# EAGLE board Aqua_D_CTRL (EAGLE 9.6.2)
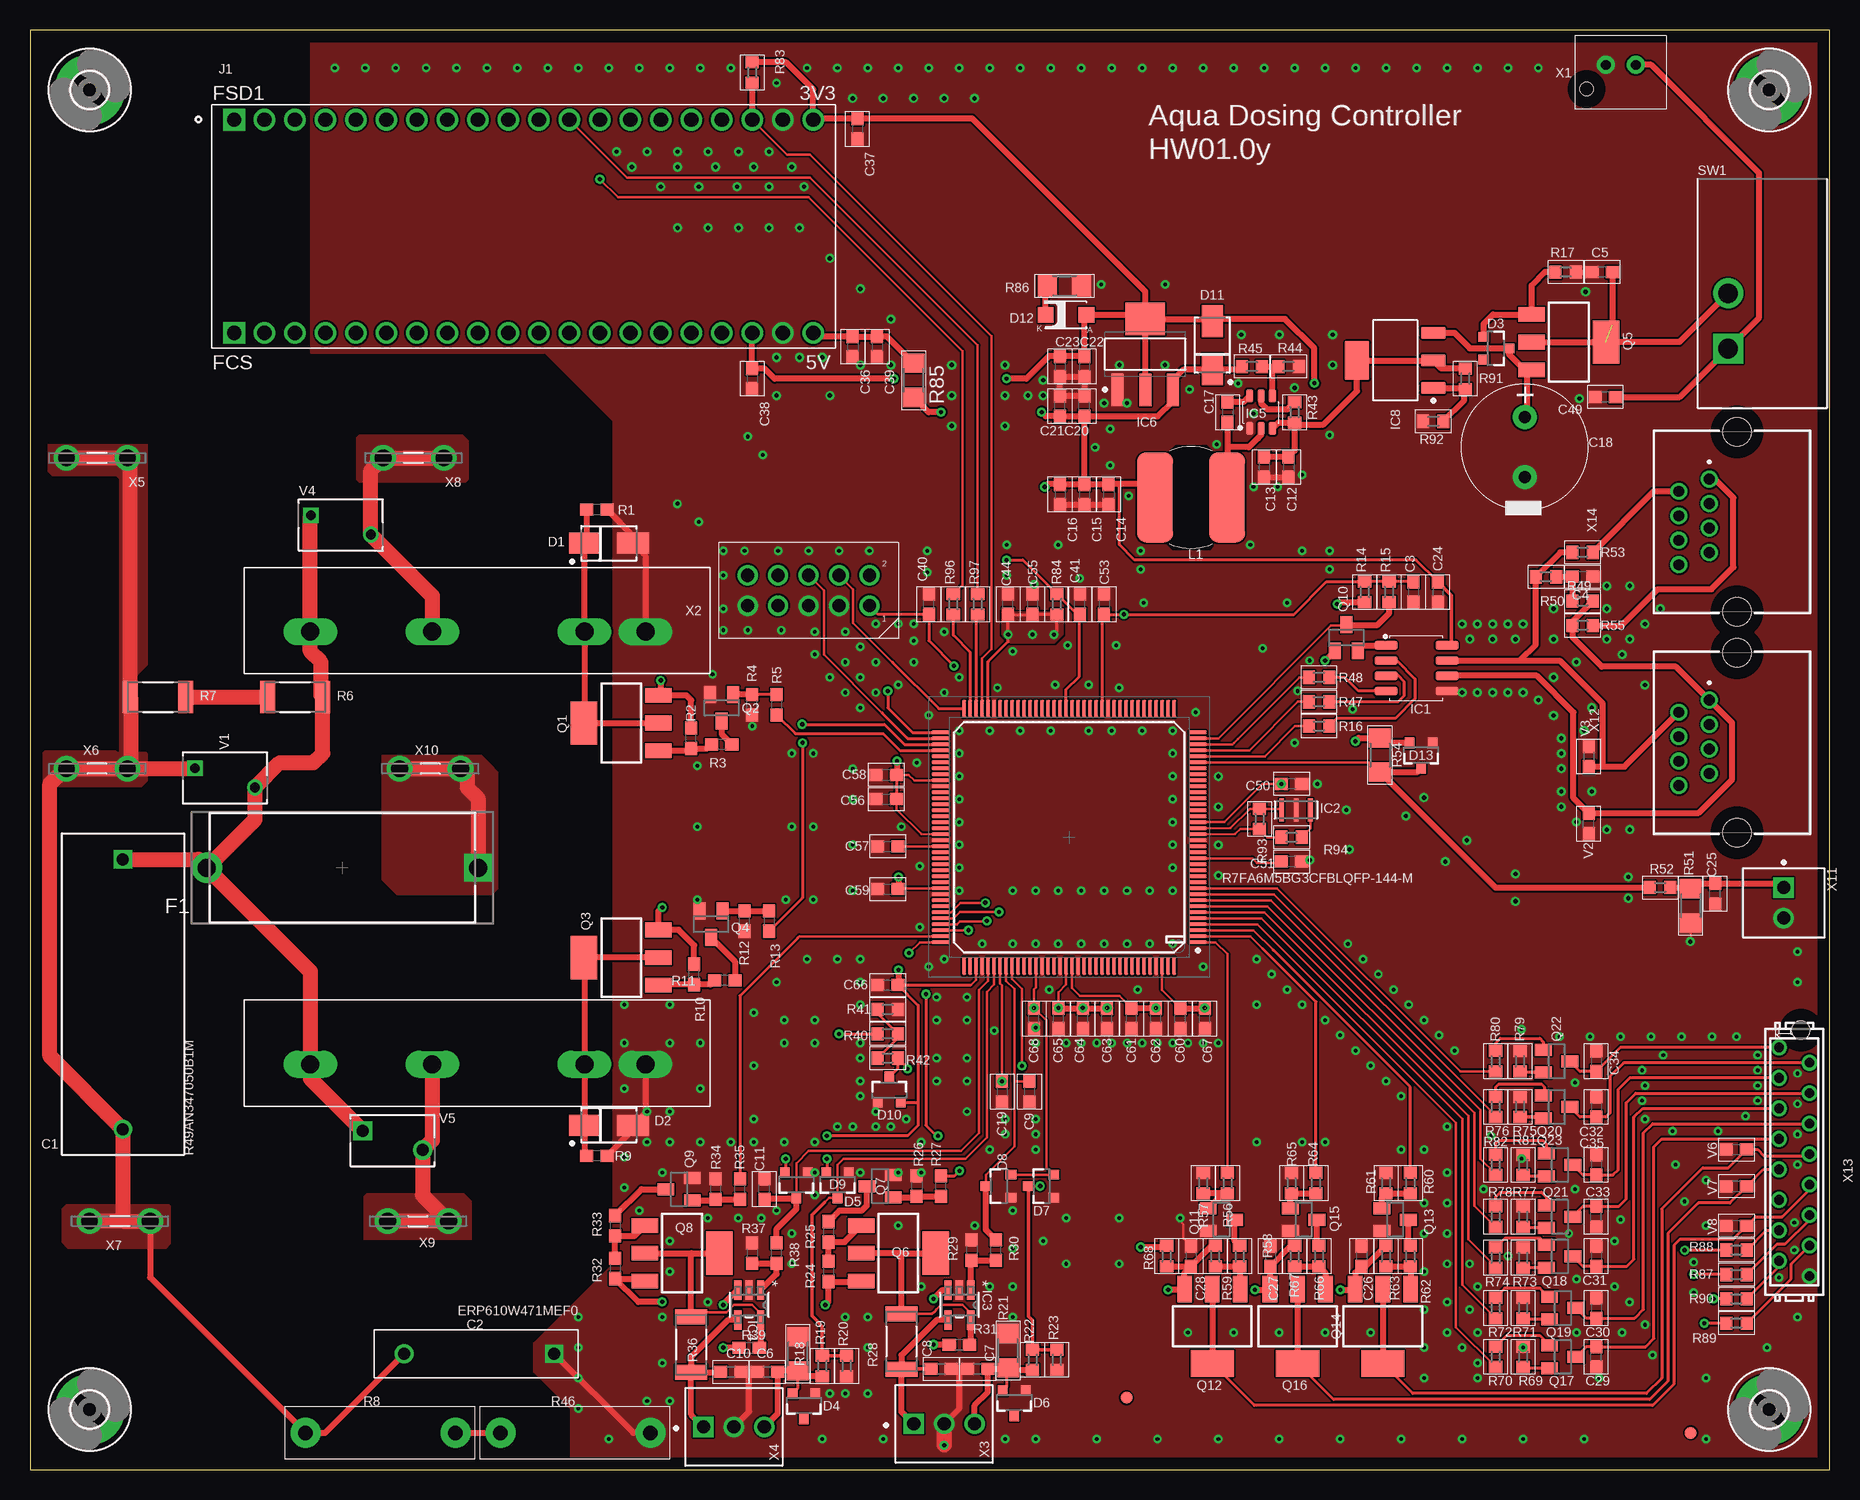
[diagram p10: board, top side]
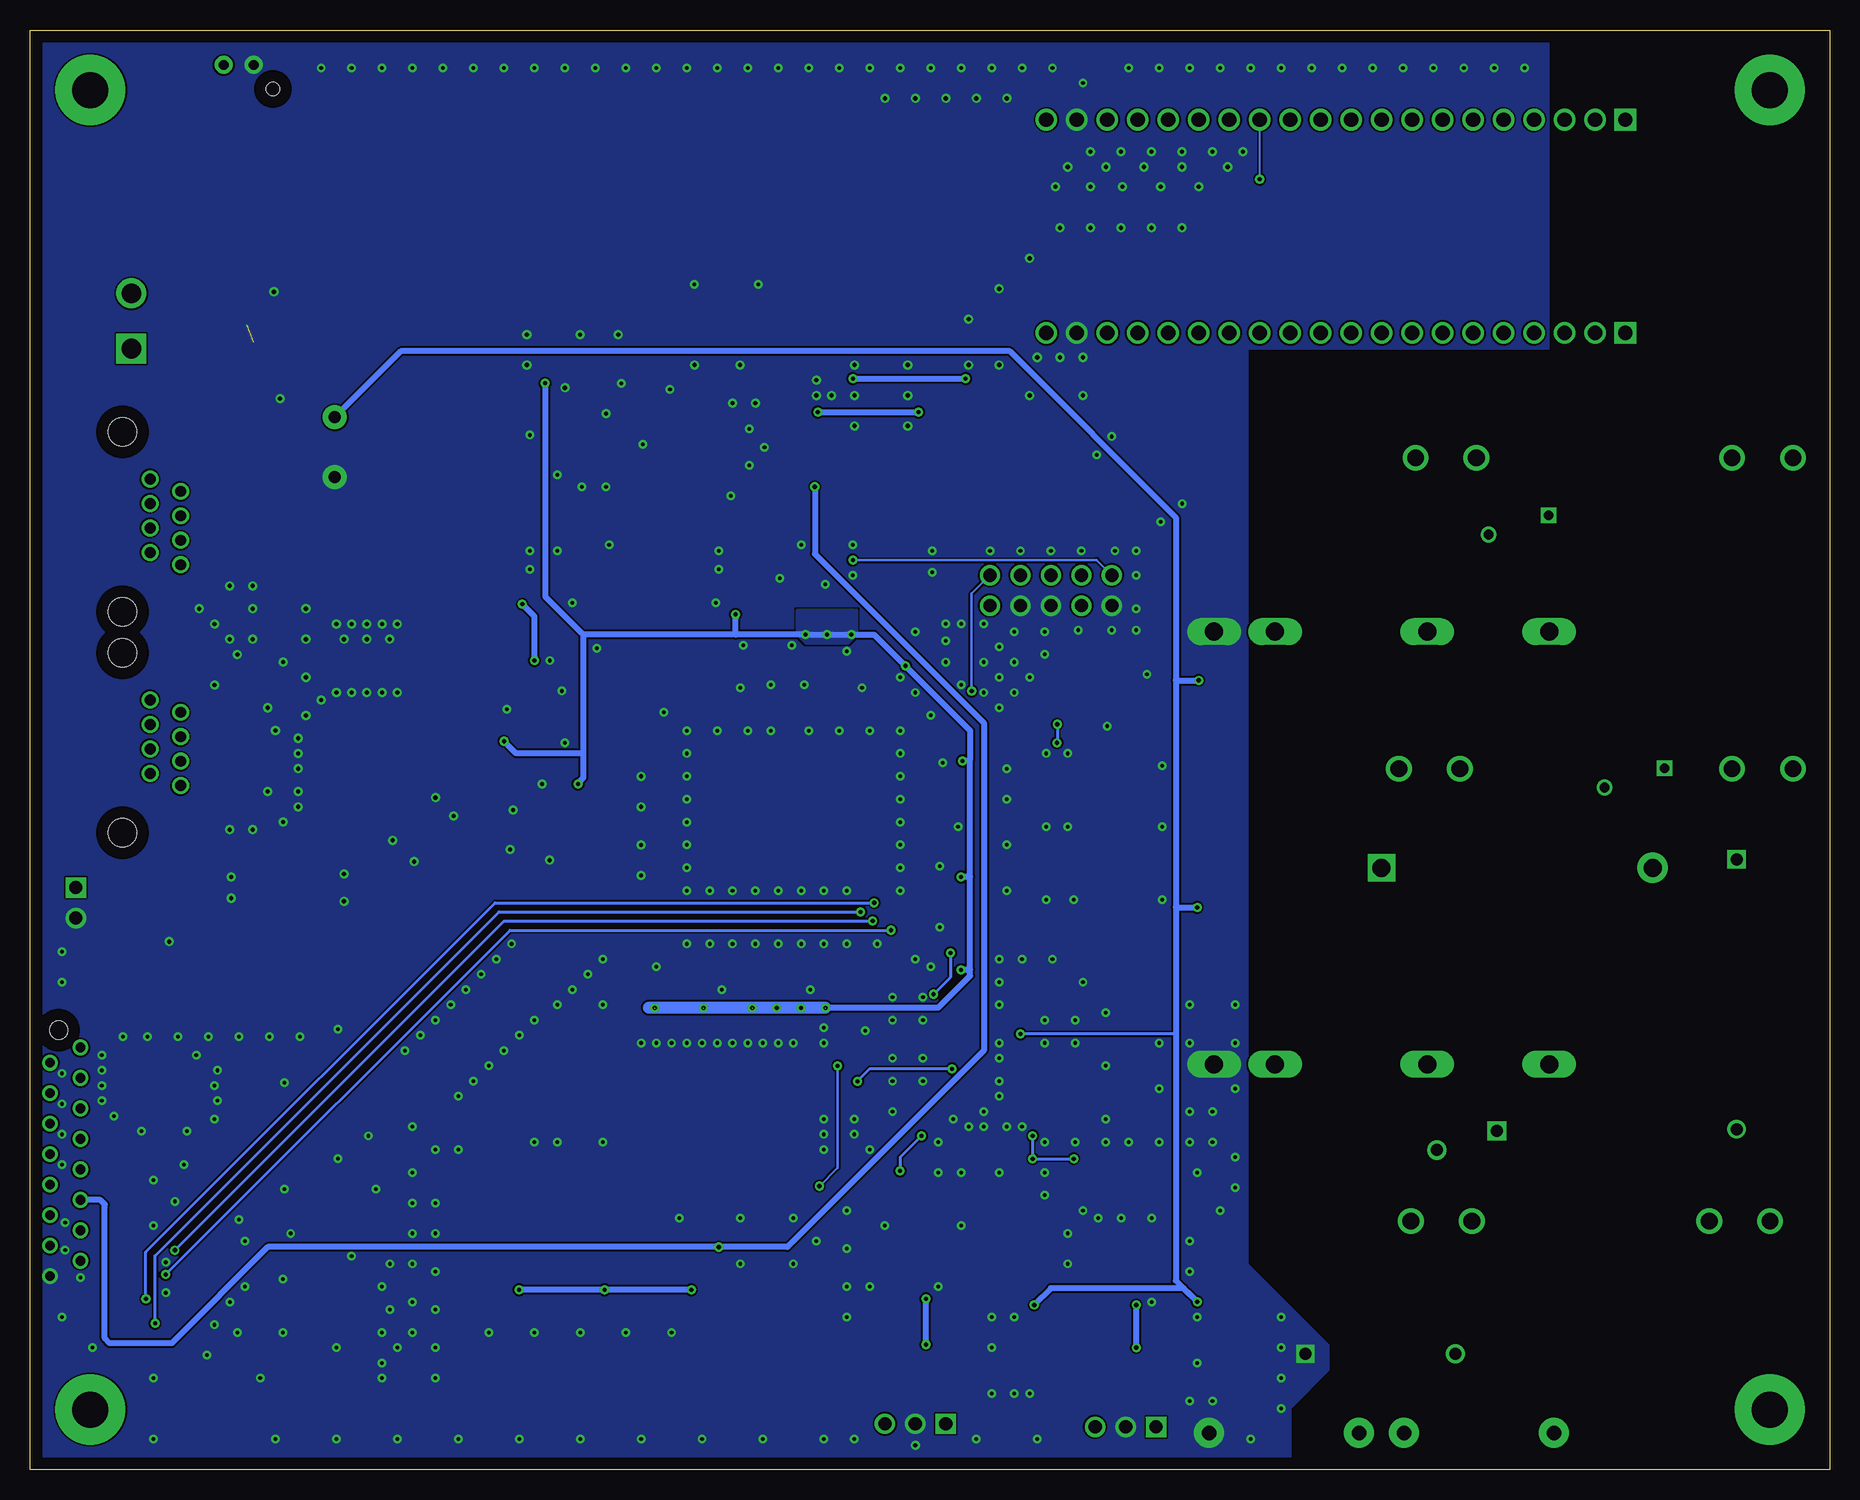
[diagram p11: board, bottom side, seen from below]

Size 150 x 120 mm. Coordinates in mm from the lower left corner, seen from the top.
Outline: 0,0 150,0 150,120 0,120 0,0
Copper layers (1*16): Top 0.035mm / dielectric 1.5mm / Bottom 0.035mm
Design rules "default *": minimum track width 6mil, minimum drill 0.35mm, track to track 6mil, track to pad 6mil, pad to pad 6mil, via to via 6mil, smd to smd 0mil, copper to edge 40mil, drill to drill 6mil, minimum pad ring 10mil, minimum via ring 8mil, stop-mask expansion 4mil, vias tented up to drill 1mm, thermal gap 10mil
Net classes: 1 Mains_N: clearance 3.2 mm to class 0, clearance 0.2 mm; 3 LV: clearance 8 mm to class 1; 4 Mains_L: clearance 8 mm to class 0, clearance 3.2 mm to class 1, clearance 8 mm to class 3

## Footprints (pad centres in the part's own frame; a part is rotated, then mirrored left to right if it is on the bottom)
R49AN347050B1M = drill 1 pad 1.55 square: 1 -11.25,0 | drill 1 pad 1.55: 2 11.25,0
CAP-P12.5-H15-W4-D1 = drill 1 square: P$1 0,0 | drill 1 pad 1.6: P$2 12.5,0
0603 = smd 1.1 x 1: 1 -0.85,0; 2 0.85,0
CAPACITOR-ELKO-RM5-10X16 = drill 1 pad 2: 1 -2.5,0; 2 2.5,0
SMA = smd 2.65 x 1.75: 1 -2.015,0; 2 2.015,0
SOT23-3 = smd 0.8 x 0.9: 1 -0.95,-1; 2 0.95,-1; 3 0,1.1
SMD1206-LED = smd 1.3 x 1.3: 1 -1.7,0; 2 1.7,0
FUSE_RM22.6 = drill 1.5 pad 2.3 square: 1 -11.3,0 | drill 1.5 pad 2.54: 2 11.3,0
FIDUCIAL = smd 1 x 1: P$1 0,0
3,0-PAD = drill 3 pad 5.842: B3,0 0,0
SOIC8 = smd 1.9 x 0.72: 1 -2.54,1.905; 2 -2.54,0.635; 3 -2.54,-0.635; 4 -2.54,-1.905; 5 2.54,-1.905; 6 2.54,-0.635; 7 2.54,0.635; 8 2.54,1.905
CSTNE8M00G520000R0 = smd 0.4 x 1.9: 1 -1.2,0; 2 0,0; 3 1.2,0
SOT-23-5 = smd 1.626 x 0.61: 1 -1.245,0.95; 2 -1.245,0; 3 -1.245,-0.95; 4 1.245,-0.95; 5 1.245,0.95
SOT23-6 = smd 0.6 x 1.1: 1 -0.95,-1.35; 2 0,-1.35; 3 0.95,-1.35; 4 0.95,1.35; 5 0,1.35; 6 -0.95,1.35
SOT223_LD1117S33TR = smd 2.7 x 1: 1 -2.95,2.3; 2 -2.95,0; 3 -2.95,-2.3 | smd 2.7 x 3.3: 4 2.95,0
SOT223_LM317AEMP = smd 2.05 x 1: 1 -3.175,2.3; 2 -3.175,0; 3 -3.175,-2.3 | smd 2.05 x 3.25: 4 3.175,0
XCVR_ESP32-PICO-KIT = drill 1.2 square: J2_1 -24.13,8.89; J3_1 -24.13,-8.89 | drill 1.2: J2_2 -21.59,8.89; J2_3 -19.05,8.89; J2_4 -16.51,8.89; J2_5 -13.97,8.89; J2_6 -11.43,8.89; J2_7 -8.89,8.89; J2_8 -6.35,8.89; J2_9 -3.81,8.89; J2_10 -1.27,8.89; J2_11 1.27,8.89; J2_12 3.81,8.89; J2_13 6.35,8.89; J2_14 8.89,8.89; J2_15 11.43,8.89; J2_16 13.97,8.89; J2_17 16.51,8.89; J2_18 19.05,8.89; J2_19 21.59,8.89; J2_20 24.13,8.89; J3_2 -21.59,-8.89; J3_3 -19.05,-8.89; J3_4 -16.51,-8.89; J3_5 -13.97,-8.89; J3_6 -11.43,-8.89; J3_7 -8.89,-8.89; J3_8 -6.35,-8.89; J3_9 -3.81,-8.89; J3_10 -1.27,-8.89; J3_11 1.27,-8.89; J3_12 3.81,-8.89; J3_13 6.35,-8.89; J3_14 8.89,-8.89; J3_15 11.43,-8.89; J3_16 13.97,-8.89; J3_17 16.51,-8.89; J3_18 19.05,-8.89; J3_19 21.59,-8.89; J3_20 24.13,-8.89
RELAY_KYOTO_KF0604D = drill 1.5 long: P$1 0,0; P$2 -5.08,0; P$3 -17.78,0; P$4 -27.94,0
SRN8040TA-220M = smd 3 x 7.5: 1 -3,0; 2 3,0
SOT223 = smd 1.219 x 2.235: 1 -2.311,-3.099; 2 0,-3.099; 3 2.311,-3.099 | smd 3.6 x 2.2: 4 0,3.099
SOT23 = smd 1 x 1.4: 1 -0.95,-1.1; 2 0.95,-1.1; 3 0,1.1
R2010 = smd 1.256 x 2.658: 1 -2.301,0; 2 2.301,0
RES-RM12.5-VR37 = drill 1.2 pad 2.5: 1 -6.25,0; 2 6.25,0
R0603 = smd 1 x 1.1: 1 -0.85,0; 2 0.85,0
R1206 = smd 1.6 x 1.803: 1 -1.422,0; 2 1.422,0
L101011MS02Q = drill 1.65 pad 2.5 square: 1 -2.85,-4.6 | drill 1.65 pad 2.5: 2 -2.85,0
LQFP-144-M = smd 1.45 x 0.3: 1 -10.725,8.75; 2 -10.725,8.25; 3 -10.725,7.75; 4 -10.725,7.25; 5 -10.725,6.75; 6 -10.725,6.25; 7 -10.725,5.75; 8 -10.725,5.25; 9 -10.725,4.75; 10 -10.725,4.25; 11 -10.725,3.75; 12 -10.725,3.25; 13 -10.725,2.75; 14 -10.725,2.25; 15 -10.725,1.75; 16 -10.725,1.25; 17 -10.725,0.75; 18 -10.725,0.25; 19 -10.725,-0.25; 20 -10.725,-0.75; 21 -10.725,-1.25; 22 -10.725,-1.75; 23 -10.725,-2.25; 24 -10.725,-2.75; 25 -10.725,-3.25; 26 -10.725,-3.75; 27 -10.725,-4.25; 28 -10.725,-4.75; 29 -10.725,-5.25; 30 -10.725,-5.75; 31 -10.725,-6.25; 32 -10.725,-6.75; 33 -10.725,-7.25; 34 -10.725,-7.75; 35 -10.725,-8.25; 36 -10.725,-8.75; 73 10.725,-8.75; 74 10.725,-8.25; 75 10.725,-7.75; 76 10.725,-7.25; 77 10.725,-6.75; 78 10.725,-6.25; 79 10.725,-5.75; 80 10.725,-5.25; 81 10.725,-4.75; 82 10.725,-4.25; 83 10.725,-3.75; 84 10.725,-3.25; 85 10.725,-2.75; 86 10.725,-2.25; 87 10.725,-1.75; 88 10.725,-1.25; 89 10.725,-0.75; 90 10.725,-0.25; 91 10.725,0.25; 92 10.725,0.75; 93 10.725,1.25; 94 10.725,1.75; 95 10.725,2.25; 96 10.725,2.75; 97 10.725,3.25; 98 10.725,3.75; 99 10.725,4.25; 100 10.725,4.75; 101 10.725,5.25; 102 10.725,5.75; 103 10.725,6.25; 104 10.725,6.75; 105 10.725,7.25; 106 10.725,7.75; 107 10.725,8.25; 108 10.725,8.75 | smd 0.3 x 1.45: 37 -8.75,-10.725; 38 -8.25,-10.725; 39 -7.75,-10.725; 40 -7.25,-10.725; 41 -6.75,-10.725; 42 -6.25,-10.725; 43 -5.75,-10.725; 44 -5.25,-10.725; 45 -4.75,-10.725; 46 -4.25,-10.725; 47 -3.75,-10.725; 48 -3.25,-10.725; 49 -2.75,-10.725; 50 -2.25,-10.725; 51 -1.75,-10.725; 52 -1.25,-10.725; 53 -0.75,-10.725; 54 -0.25,-10.725; 55 0.25,-10.725; 56 0.75,-10.725; 57 1.25,-10.725; 58 1.75,-10.725; 59 2.25,-10.725; 60 2.75,-10.725; 61 3.25,-10.725; 62 3.75,-10.725; 63 4.25,-10.725; 64 4.75,-10.725; 65 5.25,-10.725; 66 5.75,-10.725; 67 6.25,-10.725; 68 6.75,-10.725; 69 7.25,-10.725; 70 7.75,-10.725; 71 8.25,-10.725; 72 8.75,-10.725; 109 8.75,10.725; 110 8.25,10.725; 111 7.75,10.725; 112 7.25,10.725; 113 6.75,10.725; 114 6.25,10.725; 115 5.75,10.725; 116 5.25,10.725; 117 4.75,10.725; 118 4.25,10.725; 119 3.75,10.725; 120 3.25,10.725; 121 2.75,10.725; 122 2.25,10.725; 123 1.75,10.725; 124 1.25,10.725; 125 0.75,10.725; 126 0.25,10.725; 127 -0.25,10.725; 128 -0.75,10.725; 129 -1.25,10.725; 130 -1.75,10.725; 131 -2.25,10.725; 132 -2.75,10.725; 133 -3.25,10.725; 134 -3.75,10.725; 135 -4.25,10.725; 136 -4.75,10.725; 137 -5.25,10.725; 138 -5.75,10.725; 139 -6.25,10.725; 140 -6.75,10.725; 141 -7.25,10.725; 142 -7.75,10.725; 143 -8.25,10.725; 144 -8.75,10.725
EPCOS_B72205S0271K101_0 = drill 0.8 pad 1.3 square: 1 -2.5,0.8 | drill 0.8 pad 1.3: 2 2.5,-0.8
EPCOS_B72205S0271K101_MODIFIED = drill 1 pad 1.6 square: 1 -2.5,0.8 | drill 1 pad 1.6: 2 2.5,-0.8
B2B-XH-AM(LF)(SN) = drill 0.8 pad 1.5: 1 0,0; 2 2.5,0 | hole 1.1: 4.1,2
X10_100MIL_2XROW_VERT = drill 1.1 pad 1.7: 1 -5.08,1.27; 2 -5.08,-1.27; 3 -2.54,1.27; 4 -2.54,-1.27; 5 0,1.27; 6 0,-1.27; 7 2.54,1.27; 8 2.54,-1.27; 9 5.08,1.27; 10 5.08,-1.27
TE_282834-3_0 = drill 1.1 pad 1.7 square: 1 0,2.54 | drill 1.1 pad 1.7: 2 0,0; 3 0,-2.54
TE_726386-2 = drill 1.4 pad 2.15: 1 -2.54,0; 1-2 2.54,0
TE_282834-2_0 = drill 1.1 pad 1.7 square: 1 -1.27,0 | drill 1.1 pad 1.7: 2 1.27,0
615008148521 = drill 0.9: 1 3.57,1.875; 2 2.55,4.415; 3 1.53,1.875; 4 0.51,4.415; 5 -0.51,1.875; 6 -1.53,4.415; 7 -2.55,1.875; 8 -3.57,4.415 | hole 2.36: -7.5,-0.425; 7.5,-0.425
MICROMATCH-16 = drill 0.813: 1 9.525,1.27; 2 8.255,-1.27; 3 6.985,1.27; 4 5.715,-1.27; 5 4.445,1.27; 6 3.175,-1.27; 7 1.905,1.27; 8 0.635,-1.27; 9 -0.635,1.27; 10 -1.905,-1.27; 11 -3.175,1.27; 12 -4.445,-1.27; 13 -5.715,1.27; 14 -6.985,-1.27; 15 -8.255,1.27; 16 -9.525,-1.27 | hole 1.5: 10.97,-0.55

## Placement (x,y rotation side)
C1  R49AN347050B1M  [R49AN347050B1M]  7.75,39.62 270 top
C2  ERP610W471MEF0  [CAP-P12.5-H15-W4-D1]  43.69,9.65 180 top
C3  100nF/100V  [0603]  115.32,73.15 270 top
C4  100nF/100V  [0603]  129.41,74.42 0 top
C5  100nF/ 100V  [0603]  131.06,99.82 180 top
C6  100nF/100V  [0603]  61.47,8.13 0 top
C7  100nF/100V  [0603]  78.99,8.38 0 top
C8  100nF/100V  [0603]  75.95,8.38 0 top
C9  100nF/100V  [0603]  83.31,31.5 270 top
C10  100nF/100V  [0603]  58.42,8.13 0 top
C11  100nF/100V  [0603]  61.21,23.37 90 top
C12  100nF/ 100V  [0603]  104.9,83.57 270 top
C13  100nF/ 100V  [0603]  102.87,83.57 270 top
C14  10uF/25V  [0603]  89.92,81.28 270 top
C15  10uF/25V  [0603]  87.88,81.28 270 top
C16  10uF/25V  [0603]  85.85,81.28 270 top
C17  100nF/ 100V  [0603]  99.82,88.14 270 top
C18  50PX470MEFC10X20  [CAPACITOR-ELKO-RM5-10X16]  124.59,85.22 270 top
C19  100nF/ 100V  [0603]  81.03,31.5 270 top
C20  10uF/25V  [0603]  87.88,88.65 90 top
C21  100nF/ 100V  [0603]  85.85,88.65 90 top
C22  10uF/25V  [0603]  87.88,91.95 270 top
C23  100nF/ 100V  [0603]  85.85,91.95 270 top
C24  100nF/100V  [0603]  117.35,73.15 270 top
C25  100nF/100V  [0603]  140.46,48.01 90 top
C26  100nF/50V  [0603]  111,17.78 270 top
C27  100nF/50V  [0603]  103.38,17.78 270 top
C28  100nF/50V  [0603]  96.77,17.78 270 top
C29  100nF/50V  [0603]  130.56,9.4 90 top
C30  100nF/50V  [0603]  130.56,13.46 270 top
C31  100nF/50V  [0603]  130.56,17.78 270 top
C32  100nF/50V  [0603]  130.56,30.23 270 top
C33  100nF/50V  [0603]  130.56,21.08 90 top
C34  100nF/50V  [0603]  130.56,34.04 270 top
C35  100nF/50V  [0603]  130.56,25.4 270 top
C36  1uF/25V  [0603]  68.58,93.6 270 top
C37  1uF/25V  [0603]  68.96,111.76 270 top
C38  100nF/100V  [0603]  60.2,90.93 270 top
C39  100nF/100V  [0603]  70.61,93.6 270 top
C40  1uF/25V  [0603]  74.93,72.14 90 top
C41  100nF/50V  [0603]  87.5,72.14 90 top
C44  1uF/25V  [0603]  81.53,72.14 90 top
C49  100nF/ 100V  [0603]  131.32,89.41 180 top
C50  100nF/50V  [0603]  105.16,57.15 180 top
C51  100nF/50V  [0603]  105.16,50.67 180 top
C53  100nF/50V  [0603]  89.53,72.14 270 top
C55  100nF/50V  [0603]  83.57,72.14 270 top
C56  100nF/50V  [0603]  71.37,55.88 0 top
C57  100nF/50V  [0603]  71.5,51.94 0 top
C58  100nF/50V  [0603]  71.37,57.91 0 top
C59  100nF/50V  [0603]  71.5,48.39 0 top
C60  100nF/50V  [0603]  95.89,37.59 90 top
C61  100nF/50V  [0603]  91.82,37.59 90 top
C62  10uF/25V  [0603]  93.85,37.59 90 top
C63  100nF/50V  [0603]  89.79,37.59 90 top
C64  10uF/25V  [0603]  87.76,37.59 90 top
C65  1uF/25V  [0603]  85.72,37.59 90 top
C66  100nF/50V  [0603]  71.5,40.39 0 top
C67  1uF/16V  [0603]  97.92,37.59 90 top
C68  100nF/50V  [0603]  83.69,37.59 90 top
D1  SS14  [SMA]  48.26,77.22 0 top
D2  SS14  [SMA]  48.26,28.7 0 top
D3  MMBZ4696-HE3-18  [SOT23-3]  122.17,93.47 270 top
D4  PESD36VS2UT  [SOT23-3]  64.52,5.33 180 top
D5  BAS40-04,215  [SOT23-3]  67.31,23.75 180 top
D6  PESD36VS2UT  [SOT23-3]  82.04,5.59 180 top
D7  BAS40-04,215  [SOT23-3]  84.33,23.62 90 top
D8  BAS40-04,215  [SOT23-3]  80.77,23.62 90 top
D9  BAS40-04,215  [SOT23-3]  63.88,23.75 180 top
D10  BAS40-04,215  [SOT23-3]  71.63,31.62 0 top
D11  SS14  [SMA]  98.55,93.73 90 top
D12  26-21/GPC-F3138B/CA  [SMD1206-LED]  86.36,96.27 180 top
D13  BAS40-04,215  [SOT23-3]  115.95,59.56 180 top
F1  696101000002  [FUSE_RM22.6]  26.04,50.16 180 top
FID1  FIDUCIAL  [FIDUCIAL]  138.43,3.05 0 top
FID2  FIDUCIAL  [FIDUCIAL]  91.4,5.99 0 top
H1  MOUNT-PAD-ROUND3.0  [3,0-PAD]  144.97,5 0 top
H2  MOUNT-PAD-ROUND3.0  [3,0-PAD]  4.97,5 0 top
H3  MOUNT-PAD-ROUND3.0  [3,0-PAD]  144.97,115 0 top
H4  MOUNT-PAD-ROUND3.0  [3,0-PAD]  4.97,115 0 top
IC1  SN65HVD3082EDR  [SOIC8]  115.57,66.8 0 top
IC2  CSTNE8M00G520000R0  [CSTNE8M00G520000R0]  105.54,54.99 0 top
IC3  LT6106CS5#TRPBF  [SOT-23-5]  77.47,13.72 270 top
IC4  LT6106CS5#TRPBF  [SOT-23-5]  59.94,13.72 270 top
IC5  TPS54202DDCR  [SOT23-6]  102.62,88.14 0 top
IC6  LD1117S33TR  [SOT223_LD1117S33TR]  92.96,92.96 90 top
IC8  LM317AEMP  [SOT223_LM317AEMP]  113.79,92.46 180 top
J1  ESP32-PICO-KIT  [XCVR_ESP32-PICO-KIT]  41.15,103.63 0 top
K1  KB20C06A  [RELAY_KYOTO_KF0604D]  51.31,69.85 0 top
K2  KB20C06A  [RELAY_KYOTO_KF0604D]  51.31,33.78 0 top
L1  SRN8040TA-220M  [SRN8040TA-220M]  96.77,81.03 180 top
Q1  DMP6185SEQ-13  [SOT223]  49.28,62.23 90 top
Q2  2N7002  [SOT23]  57.66,63.5 180 top
Q3  DMP6185SEQ-13  [SOT223]  49.28,42.67 90 top
Q4  2N7002  [SOT23]  56.77,45.47 180 top
Q5  DMP6185SEQ-13  [SOT223]  128.27,93.98 270 top
Q6  DMP6185SEQ-13  [SOT223]  72.39,18.03 270 top
Q7  2N7002  [SOT23]  70.87,23.62 90 top
Q8  DMP6185SEQ-13  [SOT223]  54.36,18.03 270 top
Q9  2N7002  [SOT23]  54.1,23.37 90 top
Q10  BC817  [SOT23]  109.73,69.34 0 top
Q11  2N7002  [SOT23]  99.31,20.83 270 top
Q12  DMP6185SEQ-13  [SOT223]  98.55,11.94 180 top
Q13  2N7002  [SOT23]  113.79,20.83 270 top
Q14  DMP6185SEQ-13  [SOT223]  112.78,11.94 180 top
Q15  2N7002  [SOT23]  106.17,20.83 270 top
Q16  DMP6185SEQ-13  [SOT223]  105.66,11.94 180 top
Q17  BC817  [SOT23]  127.76,9.4 270 top
Q18  BC817  [SOT23]  127.76,13.46 270 top
Q19  BC817  [SOT23]  127.51,17.78 270 top
Q20  BC817  [SOT23]  127.25,30.23 270 top
Q21  BC817  [SOT23]  127.51,21.08 270 top
Q22  BC817  [SOT23]  127.25,34.04 270 top
Q23  BC817  [SOT23]  127.51,25.4 270 top
R1  10K 1%  [0603]  47.24,80.01 180 top
R2  10K 1%  [0603]  55.12,60.96 90 top
R3  10K 1%  [0603]  57.66,60.45 180 top
R4  10K 1%  [0603]  60.2,63.75 90 top
R5  100R 1%  [0603]  62.23,63.75 270 top
R6  220K 1%  [R2010]  22.1,64.39 0 top
R7  220K 1%  [R2010]  10.67,64.39 0 top
R8  RNF12FTD10M0  [RES-RM12.5-VR37]  29.21,3.05 180 top
R9  10K 1%  [0603]  47.24,26.16 180 top
R10  10K 1%  [0603]  55.37,41.27 90 top
R11  10K 1%  [0603]  57.91,40.77 180 top
R12  10K 1%  [0603]  59.56,45.72 90 top
R13  100R 1%  [0603]  61.59,45.72 270 top
R14  10K 1%  [R0603]  111.25,73.15 90 top
R15  1K 1%  [R0603]  113.28,73.15 90 top
R16  470R 1%  [R0603]  107.44,61.98 180 top
R17  10K 1%  [R0603]  128.02,99.82 180 top
R18  100R 1%  [R1206]  64.01,9.65 270 top
R19  1K 1%  [R0603]  66.04,8.64 270 top
R20  100K 1%  [R0603]  68.07,8.64 90 top
R21  100R 1%  [R1206]  81.53,9.91 270 top
R22  1K 1%  [R0603]  83.57,9.14 270 top
R23  100K 1%  [R0603]  85.6,9.14 90 top
R24  10K 1%  [0603]  66.55,16.51 270 top
R25  10K 1%  [0603]  66.55,19.81 270 top
R26  10K 1%  [0603]  73.91,23.62 270 top
R27  100R 1%  [0603]  75.95,23.62 90 top
R28  R_2010  [R2010]  72.64,10.67 270 top
R29  2.2K 1%  [0603]  78.49,18.29 270 top
R30  100R 1%  [0603]  80.52,18.29 90 top
R31  100R 1%  [0603]  77.47,10.41 0 top
R32  10K 1%  [0603]  48.77,16.76 270 top
R33  10K 1%  [0603]  48.77,20.32 270 top
R34  10K 1%  [0603]  57.15,23.37 270 top
R35  100R 1%  [0603]  59.18,23.37 90 top
R36  R_2010  [R2010]  55.12,10.41 270 top
R37  2.2K 1%  [0603]  60.2,18.03 270 top
R38  100R 1%  [0603]  62.23,18.03 90 top
R39  100R 1%  [0603]  59.94,10.16 0 top
R40  22K 1%  [R0603]  71.5,36.32 180 top
R41  2.8K 1%  [R0603]  71.5,38.35 180 top
R42  100R 1%  [R0603]  71.5,34.29 180 top
R43  22K 1%  [R0603]  105.41,88.14 270 top
R44  3K01 1%  [R0603]  104.9,91.95 0 top
R45  22K 1%  [R0603]  101.85,91.95 180 top
R46  RNF12FTD10M0  [RES-RM12.5-VR37]  45.47,3.05 180 top
R47  470R 1%  [R0603]  107.44,64.01 180 top
R48  470R 1%  [R0603]  107.44,66.04 180 top
R49  100R 1%  [R0603]  126.36,74.42 180 top
R50  100R 1%  [R0603]  129.41,72.39 0 top
R51  100K 1%  [R1206]  138.43,46.99 90 top
R52  100R 1%  [R0603]  135.89,48.51 0 top
R53  0R 1%  [R0603]  129.41,76.45 0 top
R54  1K 1%  [R1206]  112.52,59.56 90 top
R55  0R 1%  [R0603]  129.41,70.36 0 top
R56  100R 1%  [R0603]  99.82,23.88 270 top
R57  10K 1%  [R0603]  97.79,23.88 270 top
R58  10K 1%  [R0603]  100.84,17.78 270 top
R59  10K 1%  [R0603]  98.81,17.78 90 top
R60  100R 1%  [R0603]  115.06,23.88 270 top
R61  10K 1%  [R0603]  113.03,23.88 270 top
R62  10K 1%  [R0603]  115.06,17.78 270 top
R63  10K 1%  [R0603]  113.03,17.78 90 top
R64  100R 1%  [R0603]  107.19,23.88 270 top
R65  10K 1%  [R0603]  105.16,23.88 270 top
R66  10K 1%  [R0603]  107.44,17.78 270 top
R67  10K 1%  [R0603]  105.41,17.78 90 top
R68  0R 1%  [R0603]  94.74,17.78 270 top
R69  470R 1%  [R0603]  124.46,9.4 270 top
R70  100R 1%  [R0603]  122.17,9.4 90 top
R71  470R 1%  [R0603]  124.46,13.46 270 top
R72  100R 1%  [R0603]  122.17,13.46 90 top
R73  470R 1%  [R0603]  124.46,17.65 270 top
R74  100R 1%  [R0603]  122.17,17.65 90 top
R75  470R 1%  [R0603]  124.21,30.23 270 top
R76  100R 1%  [R0603]  122.17,30.23 90 top
R77  470R 1%  [R0603]  124.46,21.08 270 top
R78  100R 1%  [R0603]  122.17,21.08 90 top
R79  470R 1%  [R0603]  124.21,34.04 270 top
R80  100R 1%  [R0603]  122.17,34.04 90 top
R81  470R 1%  [R0603]  124.46,25.4 270 top
R82  100R 1%  [R0603]  122.17,25.4 90 top
R83  1K 1%  [R0603]  60.2,116.46 270 top
R84  10K 1%  [R0603]  85.6,72.14 90 top
R85  0R 1%  [R1206]  73.66,90.81 270 top
R86  82R 1%  [R1206]  86.23,98.68 180 top
R87  100R 1%  [R0603]  142.24,16.26 180 top
R88  100R 1%  [R0603]  142.24,18.29 180 top
R89  100R 1%  [R0603]  142.24,12.19 180 top
R90  100R 1%  [R0603]  142.24,14.22 180 top
R91  1k 1%  [R0603]  119.63,90.93 90 top
R92  18K 1%  [R0603]  116.97,87.38 0 top
R93  10K 1%  [R0603]  102.49,54.23 90 top
R94  0R 1%  [R0603]  105.16,52.7 180 top
R96  100R 1%  [R0603]  76.96,72.14 90 top
R97  100R 1%  [R0603]  78.99,72.14 90 top
SW1  L101011MS02Q  [L101011MS02Q]  144.4,98.04 0 top
U2  R7FA6M5BG3CFBLQFP-144-M  [LQFP-144-M]  86.61,52.7 180 top
V1  B72205S0271K101B72205S2131K101  [EPCOS_B72205S0271K101_0]  16.26,57.66 0 top
V2  0603ESDA-24N  [0603]  129.92,53.85 90 top
V3  0603ESDA-24N  [0603]  129.92,59.44 270 top
V4  B72205S0271K101B72205S2131K101  [EPCOS_B72205S0271K101_0]  25.91,78.74 0 top
V5  B72205S0271K1011  [EPCOS_B72205S0271K101_MODIFIED]  30.23,27.43 0 top
V6  0603ESDA-24N  [0603]  142.24,26.67 0 top
V7  0603ESDA-24N  [0603]  142.24,23.62 0 top
V8  0603ESDA-24N  [0603]  142.24,20.32 0 top
X1  B2B-XH-AM(LF)(SN)  [B2B-XH-AM(LF)(SN)]  133.86,117.09 180 top
X2  WF2549-2WS05S0B01  [X10_100MIL_2XROW_VERT]  64.9,73.28 180 top
X3  282834-3  [TE_282834-3_0]  76.2,3.81 90 top
X4  282834-3  [TE_282834-3_0]  58.67,3.56 90 top
X5  726386-2TE_726386-2  [TE_726386-2]  5.59,84.33 180 top
X6  726386-2TE_726386-2  [TE_726386-2]  5.59,58.42 180 top
X7  726386-2TE_726386-2  [TE_726386-2]  7.49,20.7 180 top
X8  726386-2TE_726386-2  [TE_726386-2]  31.97,84.33 180 top
X9  726386-2TE_726386-2  [TE_726386-2]  32.35,20.7 0 top
X10  726386-2TE_726386-2  [TE_726386-2]  33.36,58.42 180 top
X11  282834-2  [TE_282834-2_0]  146.18,47.24 270 top
X12  615008148521  [615008148521]  141.86,60.58 90 top
X13  MICROMATCH-16  [MICROMATCH-16]  147.07,25.65 90 top
X14  615008148521  [615008148521]  141.86,78.99 90 top

## Tracks (layer width: path | path; a pad name or v marks a point on that pad's centre or on a via)
/CONDUCTIV_PUMP_LED_ON
  Top 0.254: X13.3 133.35,32.64 132.36,31.65 132.36,24.96 131.95,24.55 C35.2 129.46,24.55 Q23.3
/CONDUCTIV_SENSOR_LED_ON
  Top 0.254: X13.4 133.85,31.37 133.04,30.56 133.04,22.55 132.42,21.93 C33.2 129.46,21.93 Q21.3
/DO_COMM_RX_EN
  Top 0.203: R16.2 105.45,61.98 102.93,59.45 U2.32
/DOSING_DIS
  Top 0.508: R52.2 138.33,48.51 R51.2 138.87,48.86 C25.2 145.84,48.86 X11.1
/PH_PUMP_LED_ON
  Top 0.254: X13.1 132.55,35.18 C34.2 129.2,33.19 Q22.3
/PH_SENSOR_LED_ON
  Top 0.254: X13.2 132.84,33.91 131.7,32.77 131.7,29.72 131.36,29.38 C32.2 129.2,29.38 Q20.3
/STATUS_LED_G
  Top 0.254: X13.6 135.25,28.83 134.49,28.07 134.49,13.34 133.77,12.61 C30.2 129.71,12.61 Q18.3
/STATUS_LED_R
  Top 0.254: X13.5 134.43,30.1 133.71,29.38 133.71,17.54 133.1,16.93 C31.2 129.46,16.93 Q19.3
/STATUS_LED_Y
  Top 0.254: X13.7 136.02,27.56 135.36,26.9 135.36,10.92 134.68,10.25 C29.2 129.71,10.25 Q17.3
AI_24V0  (via drill 0.35)
  Top 0.203: C19.1 81.04,40.36 80.86,40.54 U2.115
  Top 0.254: D10.3 72.35,33.44 R42.1 73.16,33.49 v73.16,33.4
  Bottom 0.254: v73.16,33.4 80.01,33.4 81.03,32.38 C19.1
  other vias: 81.03,32.35
AI_I_SENSE_CONDUTIV_SENSOR
  Top 0.203: 82.04,32.38 82.04,26.92 79.67,24.55 D8.3 | C9.1 82.08,32.35 82.04,32.38 | U2.116 81.36,40.72 82.04,40.04 82.04,32.38
  Top 0.508: R30.2 79.67,19.98 D8.3
AI_I_SENSE_PH_SENSOR
  Top 0.203: D9.3 63.88,22.86 63.88,25.53 64.9,26.54 77.6,26.54 79.11,28.06 79.11,39.97 79.86,40.72 U2.113
  Top 0.508: R38.2 62.23,20.07 63.88,21.72 63.88,22.61 | 63.88,22.61 63.88,22.86 | C11.1 61.3,22.61 63.88,22.61
AI_V_CONDUCTIV_SENSOR  (via drill 0.35)
  Top 0.203: v84.2,23.62 D7.3 | U2.117 81.86,40.88 82.68,40.07 v82.68,33.66
  Top 0.305: D7.3 83.23,12.78 83.57,12.45 R22.1 R23.2
  Bottom 0.203: v82.68,33.66 82.68,25.15 v84.2,23.62
AI_V_PH_SENSOR
  Top 0.203: 66.21,22.27 66.59,22.65 D5.3 67.31,25.4 67.82,25.91 77.98,25.91 79.76,27.69 79.76,39.83 80.36,40.44 U2.114
  Top 0.305: 66.21,22.27 65.19,21.24 65.19,12.79 66.04,11.94 R19.1 R20.2
CONDUCTIV_PUMP_MAINS_L_SW
  Top 1.27: K2.P$3 33.53,27.43 V5.2 32.73,22.86 X9.1-2 X9.1
  pour Top (rank 2, no thermals): 27.81,22.35 27.81,19.18 36.83,19.18 36.83,22.35 36.2,22.99 28.07,22.99 27.81,22.73
DBG_SWCLK
  Top 0.203: X2.4 68.62,73.37 68.62,70.57 71.91,67.28
  Top 0.254: U2.72 75.76,63.43 71.91,67.28
DBG_SWDIO  (via drill 0.35)
  Top 0.254: v71.5,64.9 71.5,63.5 73.55,61.45 U2.73
  Bottom 0.203: v71.5,64.9 71.5,73.03 X2.2
DBG_SWO
  Top 0.203: 71.03,63.08 66.17,67.94 66.17,73.28 X2.6
  Top 0.254: U2.74 73.16,60.95 71.03,63.08
DI_DOSING_EN
  Top 0.203: U2.31 111.71,58.95 R54.1
  Top 0.508: R52.1 122.15,48.51 R54.1 115.63,58.14 D13.3
DI_UART_RX_ESP32
  Top 0.254: R96.1 76.96,69.55 78.36,68.14 U2.71
DI_USART_RX
  Top 0.203: 109.81,70.36 108.46,70.36 99.06,60.95 U2.35
  Top 0.508: R15.1 113.28,71.37 112.27,70.36 109.81,70.36 Q10.3
DO_7XSEGMENT_1_EN
  Top 0.203: U2.1 | U2.1 98.83,43.95 99.82,42.96 R56.1
DO_7XSEGMENT_2_EN
  Top 0.203: 102.74,43.43 101.72,44.45 U2.2
  Top 0.254: R64.1 107.19,38.99 102.74,43.43
DO_7XSEGMENT_3_EN
  Top 0.203: 103.63,43.31 101.98,44.95 U2.3
  Top 0.254: R60.1 115.06,31.88 103.63,43.31
DO_BCD_A  (via drill 0.35)
  Top 0.203: v78.23,44.96 v78.23,44.95 U2.106
  Top 0.254: R87.2 v138.68,16.26
  Bottom 0.254: v138.68,16.26 109.98,44.96 v78.23,44.96
DO_BCD_B  (via drill 0.35)
  Top 0.203: v79.76,45.72 79.73,45.7 77.51,45.7 77.27,45.45 U2.105
  Top 0.254: R88.2 v137.92,18.29
  Bottom 0.254: v137.92,18.29 110.49,45.72 v79.76,45.72
DO_BCD_C  (via drill 0.35)
  Top 0.203: v80.77,46.48 77.52,46.48 76.97,45.94 75.91,45.94 U2.104
  Top 0.254: R89.2 v139.57,12.19
  Bottom 0.254: v80.77,46.48 110.91,46.48 139.57,17.82 v139.57,12.19
DO_BCD_D  (via drill 0.35)
  Top 0.203: v79.63,47.24 77.57,47.24 76.78,46.45 U2.103
  Top 0.254: R90.2 v140.34,14.22
  Bottom 0.254: v140.34,14.22 140.34,18.14 111.23,47.24 v79.63,47.24
DO_COMM_TX_EN
  Top 0.203: R47.2 105.7,64.01 101.65,59.95 U2.33
DO_CONDUCTIV_PUMP_ON_LED
  Top 0.203: R82.1 122.17,24.64 120.9,25.91 120.9,29.97 103.42,47.45 U2.8
DO_CONDUCTIV_SENSOR_DISPLAY_ON
  Top 0.203: R78.1 122.14,20.23 120.4,21.97 120.4,29.72 103.16,46.95 U2.7
DO_CONDUCTIV_SENSOR_ON  (via drill 0.35)
  Top 0.203: U2.108 74.18,43.95 v73.28,43.05
  Top 0.254: R27.2 77.05,24.47 v77.47,24.89 | v74.68,39.62 74.68,28.7 75.56,27.81 v75.69,27.81
  Bottom 0.254: v75.69,27.81 77.47,26.04 v77.47,24.89 | v73.28,43.05 73.28,41.02 v74.68,39.62
DO_CTRL_GREEN_STATUS_LED
  Top 0.203: R72.1 119.38,15.41 119.38,29.21 102.64,45.95 U2.5
DO_CTRL_RED_STATUS_LED
  Top 0.203: R74.1 122.17,16.89 119.89,19.18 119.89,29.46 102.9,46.45 U2.6
DO_CTRL_YELLOW_STATUS_LED
  Top 0.203: R70.1 118.87,11.85 118.87,28.91 102.33,45.45 U2.4
DO_ESP32_EN
  Top 0.203: J1.J2_18 63.12,109.6 65.02,109.6 80.14,94.49 80.14,68.39 79.36,67.61 U2.69
  Top 0.508: R83.2 J1.J2_18
DO_PH_PUMP_ON_LED
  Top 0.203: R80.1 119.21,33.19 103.94,48.45 U2.10
DO_PH_SENSOR_DISPLAY_ON
  Top 0.203: R76.1 122.17,29.46 103.68,47.95 U2.9
DO_PH_SENSOR_ON
  Top 0.203: R35.2 59.18,24.26 | 64.01,44.32 64.14,44.45 U2.107
  Top 0.254: R35.2 59.18,39.5 64.01,44.32
DO_UART_TX_ESP32
  Top 0.254: R97.1 78.86,71.16 U2.70
DO_USART_TX
  Top 0.203: R48.2 105.83,66.04 100.68,60.89 100.37,60.58 100.25,60.45 U2.34
DO_V_CONDUCTIV_PUMP_ON  (via drill 0.35)
  Top 0.254: R13.2 64.39,47.66 v64.39,60.58 | v64.37,62.12 71.23,62.12 72.89,60.45 U2.75
  Bottom 0.254: v64.37,62.12 64.37,60.6 v64.39,60.58
DO_V_PH_PUMP_ON
  Top 0.254: R5.2 63.79,61.34 71.12,61.34 72.51,59.95 U2.76
ESP32_RXD
  Top 0.203: R97.2 78.99,93.73 65.02,107.7 49.78,107.7 J1.J2_12
ESP32_TXD  (via drill 0.35)
  Top 0.203: R96.2 77.72,73.75 77.72,93.22 64.9,106.05 49.02,106.05 v47.5,107.57
  Bottom 0.152: v47.5,107.57 J1.J2_13
GND  (via drill 0.3, 0.35)
  Top 0.152: C28.1 96.14,19.27 96.14,20.45 96.01,20.57
  Top 0.203: R51.1 138.43,44.03 v138.41,44.01
  Top 0.508: C7.1 77.47,8.38 | 77.47,8.38 C8.2 | X3.2 77.47,5.08 77.47,8.38 | C10.2 59.94,8.13 | 59.94,8.13 C6.1 | X4.2 59.94,4.83 59.94,8.13 | C16.2 C14.2 | C13.2 C12.2 | R17.1 C5.2 | R9.1 50.27,28.34 D2.2 51.31,29.73 K2.P$1 | K1.P$1 51.31,76.18 D1.2 50.27,77.83 R1.1 | R46.1 50.29,3.05 C2.P$1 | C21.2 C23.2 C22.2 C20.2 C21.2
  Top 1.27: X3.2 v76.2,2.03
  other vias: 147.32,40.64 147.32,33.02 147.32,30.48 147.32,27.94 147.32,25.4 147.32,12.7 144.78,10.16 139.7,7.62 139.7,2.54 81.28,27.94 129.54,2.54 124.46,2.54 119.38,2.54 114.3,2.54 109.22,2.54 104.14,2.54 99.06,2.54 93.98,2.54 88.9,2.54 83.82,2.54 81.28,2.54 71.12,2.54 66.04,2.54 48.26,2.54 45.72,5.08 45.72,7.62 45.72,10.16 45.72,12.7 53.34,16.51 53.34,19.05 50.8,21.59 147.32,43.18 125.73,116.84 123.19,116.84 120.65,116.84 118.11,116.84 115.57,116.84 113.03,116.84 110.49,116.84 107.95,116.84 105.41,116.84 102.87,116.84 100.33,116.84 97.79,116.84 95.25,116.84 92.71,116.84 90.17,116.84 87.63,116.84 85.09,116.84 82.55,116.84 80.01,116.84 77.47,116.84 74.93,116.84 72.39,116.84 69.85,116.84 67.31,116.84 64.77,116.84 62.23,115.57 58.42,116.84 55.88,116.84 53.34,116.84 50.8,116.84 48.26,116.84 45.72,116.84 43.18,116.84 40.64,116.84 38.1,116.84 35.56,116.84 33.02,116.84 30.48,116.84 27.94,116.84 25.4,116.84 97.79,41.91 74.93,41.91 81.28,29.21 80.01,26.67 83.82,26.67 83.82,27.94 83.82,29.21 83.82,36.83 83.82,35.56 86.36,35.56 88.9,35.56 91.44,35.56 92.71,35.56 95.25,35.56 93.98,35.56 90.17,35.56 87.63,35.56 96.52,35.56 97.79,35.56 99.06,35.56 100.33,11.43 104.14,11.43 107.95,11.43 111.76,11.43 137.16,25.4 139.7,24.13 139.7,20.32 132.08,19.05 68.58,48.26 68.58,52.07 68.58,55.88 68.58,58.42 69.22,63.5 73.66,67.31 73.66,69.09 76.2,69.85 77.47,66.04 76.2,64.77 144.02,33.27 134.37,33.27 134.62,32 144.02,32 144.02,30.73 134.37,30.73 134.62,29.21 143,29.46 140.72,28.19 136.91,28.19 137.92,22.35 147.07,20.57 147.07,18.29 145.8,16 138.68,17.27 144.02,34.54 136.14,34.54 140.21,36.07 135.13,36.07 137.67,36.07 142.24,36.07 68.58,114.3 71.12,114.3 73.66,114.3 76.2,114.3 78.74,114.3 52.58,106.93 58.93,106.93 64.52,106.93 63.5,108.58 57.15,108.58 60.33,108.58 53.98,108.58 50.16,108.58 48.9,109.86 51.44,109.86 53.98,109.86 56.52,109.86 59.05,109.86 61.59,109.86 55.75,106.93 61.59,106.93 53.98,103.5 56.52,103.5 59.05,103.5 61.59,103.5 64.14,103.5 66.67,100.97 69.22,98.42 71.75,95.89 76.83,92.08 76.83,89.53 76.83,87 81.28,92.08 81.28,89.53 81.28,87 83.19,89.53 84.45,90.81 84.45,89.53 89.53,88.9 91.44,88.9 94.61,92.08 90.81,92.08 62.23,92.71 62.23,89.53 64.14,92.71 66.67,89.53 69.22,92.08 71.75,92.08 66.04,92.71 104.14,94.61 100.97,94.61 105.41,90.17 108.58,92.08 108.58,94.61 131.44,71.75 131.44,73.66 133.35,73.66 131.44,69.22 133.35,69.22 134.62,70.48 135.89,71.75 127,71.75 127,69.22 128.91,67.31 123.83,69.22 121.92,69.22 120.02,69.22 119.38,70.48 120.65,70.48 121.92,70.48 123.19,70.48 124.46,70.48 119.38,64.77 120.65,64.77 121.92,64.77 123.19,64.77 124.46,64.77 125.73,64.14 127,62.87 127.64,60.96 127,66.04 130.18,63.5 129.54,61.59 130.18,56.52 127.64,59.69 127.64,58.42 127.64,56.52 127.64,55.24 128.91,53.98 131.44,53.34 133.35,53.34 134.62,65.41 132.72,67.94 99.06,49.53 106.68,50.8 99.06,52.07 99.06,55.24 99.06,57.78 107.31,57.15 106.05,38.73 102.23,38.73 102.23,27.3 106.05,27.3 107.95,37.47 107.95,27.3 114.3,26.67 114.3,31.11 118.11,28.57 120.02,17.14 120.65,15.24 120.02,13.34 120.65,11.43 138.68,14.73 132.72,11.43 133.35,13.97 135.25,9.53 130.81,7.62 124.46,10.16 128.91,11.43 128.91,15.88 128.27,19.68 123.19,17.78 118.11,24.77 118.11,22.23 118.11,19.68 118.11,17.14 118.11,13.97 118.11,11.43 119.38,10.16 120.65,8.89 120.65,7.62 116.2,7.62 116.2,10.16 116.2,13.34 116.2,16.51 116.2,19.68 116.2,22.23 116.2,26.67 96.52,11.43 81.92,12.7 81.92,21.59 86.36,20.95 90.81,20.95 95.89,20.95 90.81,17.14 86.36,17.14 84.45,19.05 78.74,20.32 72.39,20.32 74.3,24.77 74.3,15.24 80.01,15.24 81.92,15.24 81.92,18.41 67.94,6.35 66.67,6.35 67.94,12.7 69.85,12.7 69.85,10.16 69.85,6.35 51.44,5.71 53.34,5.71 52.7,12.7 52.7,8.89 56.52,13.97 59.05,20.95 60.96,20.95 62.23,21.59 56.52,20.95 63.5,19.68 63.5,17.14 65.41,22.86 65.41,24.77 65.41,27.3 62.87,27.3 60.33,27.3 58.42,27.3 53.34,27.3 55.88,27.3 55.88,31.75 55.88,35.56 52.7,24.77 49.53,23.5 49.53,26.04 51.44,27.3 51.44,29.84 53.34,29.84 53.34,38.73 53.34,35.56 49.53,38.73 49.53,35.56 49.53,31.75 60.33,33.66 60.33,29.21 60.33,38.1 62.23,40.64 64.77,42.55 67.31,42.55 69.22,42.55 69.22,40.64 69.22,38.73 62.87,37.47 65.41,37.47 65.41,35.56 62.87,35.56 69.22,35.56 69.22,34.29 69.22,32.38 69.22,31.11 70.48,29.84 73.03,29.21 71.75,28.57 70.48,28.57 68.58,28.57 67.31,28.57 75.56,39.37 78.11,39.37 78.11,37.47 75.56,37.47 75.56,34.29 78.11,34.29 78.11,32.38 75.56,32.38 78.11,29.84 74.3,27.3 72.39,24.77 69.22,24.77 74.93,62.87 72.39,65.41 70.48,67.31 69.22,66.04 70.48,64.77 67.94,67.31 69.22,68.58 67.94,69.85 70.48,70.48 72.39,70.48 73.66,70.48 65.41,69.85 65.41,67.94 66.67,66.04 67.94,64.77 77.47,61.59 80.01,61.59 82.55,61.59 85.09,61.59 88.27,65.41 88.27,61.59 90.17,61.59 92.71,61.59 95.25,61.59 95.25,59.69 95.25,57.78 95.25,55.88 95.25,53.98 95.25,52.07 95.25,50.16 95.25,48.26 93.34,48.26 91.44,48.26 89.53,48.26 87.63,48.26 85.72,48.26 85.72,43.81 87.63,43.81 89.53,43.81 91.44,43.81 93.34,43.81 95.25,43.81 83.82,43.81 81.92,43.81 79.38,43.81 76.2,42.55 83.82,48.26 81.92,48.26 77.47,48.26 77.47,50.16 77.47,52.07 77.47,53.98 77.47,55.88 77.47,57.78 77.47,59.69 109.86,43.81 111.12,42.55 112.39,41.27 113.67,40.01 114.94,38.73 116.2,37.47 117.47,36.2 118.75,34.92 113.03,32.38 111.76,33.66 110.49,34.92 109.22,36.2 104.78,40.01 103.5,41.27 102.23,42.55 132.59,36.07 130.05,36.07 127.51,36.07 124.33,36.7 128.78,32.26 121.79,27.81 124.33,25.91 128.78,23.37 121.16,23.37 132.59,20.83 132.08,15.24 134.62,12.06 84.96,40.01 92.33,40.01 80.39,36.58 105.66,64.9 106.68,67.44 110.24,63.37 105.41,60.58 129.67,98.17 129.16,89.28 101.98,88.01 83.69,73.79 87.5,74.3 85.47,65.41 86.49,68.71 81.92,68.2 80.64,65.15 90.81,65.15 90.55,68.71 102.74,68.45 97.16,63.12 109.73,54.99 109.98,51.69 74.17,45.21 74.17,50.29 72.64,53.59 73.91,58.93 55.63,58.67 55.63,47.5 55.63,53.59 63.5,53.59 65.28,53.59 65.28,59.69 63.5,59.69 65.28,47.5 62.99,47.5 60.2,61.98 56.9,66.29 55.75,78.99 53.98,80.52 59.82,86.11 61.09,84.58 89.28,98.81 94.61,98.81 116.2,56.01 114.68,54.48 117.98,50.67 119.76,52.45 123.83,49.66 123.83,47.37 133.22,49.4 133.22,47.62 81.41,74.55 81.41,77.09 85.72,77.09 74.8,74.8 74.8,76.58 67.44,76.58 69.98,76.58 64.9,76.58 62.36,76.58 59.56,76.58 57.78,76.58 57.78,74.55 57.78,71.75 62.61,69.98 59.82,69.98 57.78,69.98 90.04,83.69 90.04,86.74 88.77,85.22 98.93,85.47 100.71,90.55 96.65,90.04 108.33,86.23 108.33,76.58 106.05,76.58 106.05,82.93 104.01,81.92 101.98,81.92 101.73,77.09 108.33,75.06 104.78,72.26 92.84,72.26 92.58,75.06 91.57,81.15 92.58,76.58
  pour Top (rank 6, no thermals): 149.48,0 149.48,119.89 23.44,119.89 23.44,93.09 42.93,93.09 48.64,87.38 48.64,17.14 42.04,10.54 42.04,8.13 45.09,5.08 45.09,0
  pour Bottom (rank 6, no thermals): 34.19,119.2 48.51,104.88 48.51,17.14 41.78,10.41 41.78,8.26 44.96,5.08 44.96,1.02 148.97,1.02 148.97,119.2
  cutout Top: 95,84.84 95.5,85.34 96.52,85.34 98.04,85.34 98.55,84.84 98.55,76.96 98.3,76.71 95.25,76.71 94.74,77.22 94.74,84.58
  pour Bottom: 48.9,93.43 23.43,93.43 23.43,119.04 23.51,119.11 58.32,119.11 58.29,119.08 58.29,95.85 48.9,86.45
MAINS_L
  Top 1.27: X10.1-2 X10.1 36.44,57.88 36.44,56.85 37.34,55.96 F1.1
  pour Top (no thermals): 29.34,59.56 37.59,59.56 38.35,58.8 38.99,58.17 38.99,49.15 38.99,48.39 38.48,47.88 30.61,47.88 29.59,48.9 29.34,49.15
MAINS_L_F
  Top 1.27: F1.2 18.76,54.19 V1.2 20.83,58.93 23.62,58.93 24.4,59.7 R6.2 24.27,64.52 24.27,67.3 23.37,68.2 K1.P$4 23.37,79.5 V4.1 | C1.1 14.03,50.87 F1.2 | V5.1 23.37,32.59 K2.P$4 23.37,41.53 F1.2
MAINS_N
  Top 0.508: X7.1 10.01,20.67 10.01,16 R8.2 24.58,3.05 C2.P$2
  Top 1.27: V1.1 13.72,58.42 X6.1-2 2.92,58.42 1.65,57.15 1.65,34.47 C1.2 7.75,20.7 | 7.75,20.7 X7.1-2 | 7.75,20.7 X7.1 | 8.38,64.37 8.38,58.67 X6.1 | X5.1-2 X5.1 8.37,84.09 R7.1
  pour Top (no thermals): 1.52,85.47 9.78,85.47 9.78,67.06 8.13,65.41 8.13,59.82 9.65,59.82 9.78,59.69 9.78,57.4 9.4,57.02 9.27,56.9 1.14,56.9 0.89,57.15 0.89,59.56 1.27,59.94 1.91,59.94 7.11,59.94 7.24,59.82 7.49,59.82 7.49,82.55 7.37,82.68 7.24,82.8 2.03,82.8 1.91,82.8 1.52,83.19
  pour Top (no thermals): 3.05,22.1 11.56,22.1 11.68,21.97 11.68,18.8 11.3,18.41 3.17,18.41 2.67,18.92 2.67,21.72
N$1
  Top 0.508: Q1.2 Q1.4 46.23,62.28 K1.P$2 46.23,77.2 D1.1 46.39,77.36 R1.2
N$2  (1 unrouted)
  Top 0.508: Q5.2 Q5.4 137.49,93.98 SW1.2 | C5.1 131.91,95.42
N$3
  Top 0.508: R3.2 56.47,60.11 R2.1 54.93,59.92 Q1.1
N$4
  Top 1.27: R7.2 R6.1
N$5
  Top 0.508: Q3.2 Q3.4 46.23,42.62 K2.P$2 46.24,33.77 D2.1 46.24,26.31 R9.2
N$6
  Top 0.508: Q2.3 57.66,61.3 R3.1
N$7  (via drill 0.35)
  Top 0.508: R31.1 v75.31,10.41 | v75.31,14.22 76.05,14.96 IC3.3
  Bottom 0.508: v75.31,10.41 v75.31,14.22
N$8
  Top 0.254: R5.1 R4.2
  Top 0.508: R4.2 Q2.1
N$9  (via drill 0.35)
  Top 0.508: Q10.1 107.97,67.44 v107.95,67.44 | v108.97,72.14 109.13,72.3 R14.1
  Bottom 0.508: v107.95,67.44 107.95,71.12 v108.97,72.14
N$10
  Top 0.508: R91.2 117.64,91.78 IC8.2 110.87,92.46 | IC8.4 110.87,92.46 | R43.2 105.41,84.92 C12.1 C13.1 | R43.2 105.58,87.12 107.82,87.12 110.62,89.92 110.62,92.2 110.87,92.46 | IC5.3 104.07,87.29 R43.2
N$11
  Top 0.508: Q3.1 52.44,40.42 R10.1 56.72,40.42 R11.2
N$12
  Top 0.508: Q4.3 58.76,42.37 R11.1
N$13
  Top 0.508: R24.1 R25.2 67.91,18.96 Q6.1
N$14
  Top 0.508: R13.1 R12.2 Q4.1
N$15
  Top 0.508: R25.1 67.48,21.59 69.34,21.59 69.77,22.01 Q7.3
N$16
  Top 0.508: R17.2 126.29,99.82 125.17,98.7 Q5.1 121.94,96.29 121.17,95.52 D3.1
N$17
  Top 0.508: R27.1 R26.2 73.81,22.67 Q7.1
N$18
  Top 0.508: IC3.1 78.42,17.37 R29.2 R30.1
N$19
  Top 0.203: R28.1 75.2,12.97 75.44,13.21 75.56,13.34 75.95,13.72 77.72,13.72 78.42,13.02 IC3.5
  Top 0.508: R31.2 78.42,10.51 IC3.5 | R28.1 72.64,18.03 | 72.64,18.03 Q6.2 | 72.64,18.03 Q6.4
N$20
  Top 0.508: IC8.1 119.56,90.16 | 119.56,90.16 R91.1 | R92.2 119.56,89.12 119.56,90.16
N$21
  Top 0.508: R32.1 R33.2 50.38,19.47 Q8.1
N$22
  Top 0.508: R33.1 50.97,23.37 Q9.3
N$23
  Top 0.508: Q9.1 57.05,22.42 R34.2 R35.1
N$24  (via drill 0.35)
  Top 0.508: R39.1 v57.78,10.16 | v57.78,13.72 57.78,13.75 IC4.3
  Bottom 0.508: v57.78,10.16 v57.78,13.72
N$25
  Top 0.508: IC4.1 62.23,16.3 R38.1 R37.2
N$26
  Top 0.203: R36.1 55.49,13.08 58.05,13.08 58.68,13.72 60.2,13.72 60.89,13.02 IC4.5
  Top 0.508: IC4.5 60.89,10.26 R39.2 | Q8.2 55.12,18.03 | 55.12,18.03 Q8.4 | R36.1 55.12,18.03
N$27
  Top 0.254: R41.2 70.65,38.02 R40.1 72.35,35.99 R42.2
N$28
  Top 0.508: R8.1 R46.2
N$29
  Top 0.508: Q10.2 111.14,68.71 IC1.1
N$30
  Top 0.508: C17.2 99.82,85.22 | 99.82,85.22 99.82,81.07 L1.1 | IC5.2 102.62,86.23 102.36,85.98 101.6,85.22 99.82,85.22
N$31
  Top 0.254: IC1.2 113.92,67.44 115.44,65.91 115.44,64.26 113.79,62.61 108.93,62.61 R16.1
N$32
  Top 0.508: IC5.5 102.62,88.9 103.12,88.39 104.81,88.39 R43.1
N$33
  Top 0.508: R45.1 103.63,91.95 | 103.63,91.95 R44.1 | IC5.4 103.57,91.88 103.63,91.95
N$34
  Top 0.508: IC5.6 101.17,88.99 C17.1
N$35
  Top 0.254: R88.1 144.74,19.94 X13.13
N$36
  Top 0.508: Q11.1 99.46,23.03 R56.2 R57.2
N$37
  Top 0.254: R47.1 114.05,64.01 114.55,64.52 114.55,65.66 114.05,66.17 IC1.3
N$38
  Top 0.254: IC1.4 110.74,64.9 109.6,66.04 R48.1
N$39
  Top 0.508: R58.1 100.41,19.05 Q11.3
N$40
  Top 0.254: R87.1 145.63,18.8 146.3,18.8 148.34,20.83 X13.12
N$41
  Top 0.508: R59.1 R58.2 100.86,16.91 Q12.1
N$42
  Top 0.508: R49.1 C4.1 R50.1
N$43
  Top 0.254: R90.1 145.8,16.93 X13.15
N$44
  Top 0.254: Q17.2 124.56,8.45 R69.2
N$45
  Top 0.254: R70.2 123.1,11.18 125.83,11.18 Q17.1
N$46
  Top 0.508: Q13.1 112.69,22.69 R61.2 R60.2
N$47
  Top 0.508: R62.1 114.89,18.8 Q13.3
N$48
  Top 0.508: R63.1 R62.2 115.09,16.91 Q14.1
N$49
  Top 0.203: IC2.3 106.74,53.44 R94.1
N$50
  Top 0.254: Q18.2 124.56,12.51 R71.2
N$51
  Top 0.254: Q18.1 126.56,14.41 125.86,15.11 122.94,15.11 122.17,14.35 R72.2
N$52
  Top 0.508: Q15.1 105.07,22.94 R65.2 R64.2
N$53
  Top 0.508: R66.1 107.27,18.8 Q15.3
N$54
  Top 0.508: R67.1 R66.2 107.97,16.4 Q16.1
N$55
  Top 0.203: U2.19 100.46,52.96 100.88,53.38 R93.1 103.16,52.7 R94.2
N$56
  Top 0.254: Q19.2 124.49,16.83 R73.2
N$57
  Top 0.254: Q19.1 125.86,19.28 122.95,19.28 R74.2
N$58
  Top 0.254: R89.1 146.81,15.91 146.81,17.14 147.7,18.03 X13.14
N$61
  Top 0.305: R75.2 126.05,29.38 Q20.2
N$62
  Top 0.254: R76.2 122.17,31.88 122.43,32.13 125.98,32.13 126.24,31.88 126.24,31.26 Q20.1
N$63
  Top 0.203: U2.15 101.88,50.95 102.29,50.55 104.18,50.55 C51.2
N$64
  Top 0.254: Q21.2 124.56,20.13 R77.2
N$65
  Top 0.254: R78.2 122.17,22.73 122.56,23.11 125.98,23.11 126.41,22.69 Q21.1
N$66
  Top 0.203: U2.20 100.08,53.47 101.69,55.08 R93.2 104.25,55.08 IC2.1
N$67
  Top 0.254: Q22.2 124.31,33.09 R79.2
N$68
  Top 0.254: R80.2 122.17,35.56 122.56,35.94 125.83,35.94 126.15,35.62 Q22.1
N$70
  Top 0.254: Q23.2 124.56,24.45 R81.2
N$71
  Top 0.254: R82.2 122.17,27.18 122.43,27.43 126.11,27.43 126.41,27.14 Q23.1
N$83
  Top 0.508: D12.2 84.66,98.53 R86.2
N$88
  Top 0.203: C57.2 75.88,51.94 U2.92
NRST  (via drill 0.35)
  Top 0.203: 87.46,71.33 C41.1
  Top 0.254: U2.55 86.36,65.02 87.46,66.12 87.46,71.33 | v81.41,75.82 82.77,75.82 R84.2 87.3,71.29 C41.1
  Bottom 0.203: v81.41,75.82 61.09,75.82 X2.10
PH_PUMP_MAINS_L_SW
  Top 1.27: K1.P$3 33.53,72.82 V4.2 28.41,83.31 X8.1-2 X8.1
  pour Top (no thermals): 27.18,85.98 27.18,82.55 27.43,82.3 36.32,82.3 36.58,82.55 36.58,85.72 36.07,86.23 28.19,86.23 27.43,86.23
RS485_A
  Top 0.508: R50.2 128.56,70.69 R55.1 128.56,69.38 131.01,66.93 137.2,66.93 X12.1 141.88,62.25 141.88,57.53 139.09,54.74 129.96,54.74 V2.2 128.65,55.97 128.65,63.12 125.6,66.17 IC1.6
RS485_A_NEXT
  Top 0.508: R55.2 132.65,70.36 135.67,73.38 140.16,73.38 142,75.22 142,81.01 140.45,82.56 X14.1
RS485_B
  Top 0.508: R53.1 127.55,76.45 R49.2 125.52,68.75 124.21,67.44 | 124.21,67.44 127.51,67.44 131.06,63.88 131.06,58.59 | V3.2 131.06,58.59 | IC1.7 124.21,67.44 | 131.06,58.59 132.9,58.59 X12.2
RS485_B_NEXT
  Top 0.508: R53.2 135.35,81.54 X14.2
V5V0_ESP32
  Top 0.508: R85.1 71.44,94.45 C39.1 C36.1 65.57,94.45 J1.J3_20
V_5V0  (via drill 0.35)
  Top 0.254: C24.1 115.53,75.82 92.08,75.82 90.81,77.09 90.81,82.13
  Top 0.305: IC1.8 118.49,69.09 118.49,72.86 C24.1
  Top 0.508: C15.1 C16.1 84.8,82.13 v84.58,81.92 | C15.1 C14.1 90.81,82.13 92.67,82.13 L1.2 | C15.1 C20.1 | v92.58,18.54 94.65,18.54 R68.1 | R45.2 100.77,91.71 D11.1 96.2,91.71 95.26,90.78 IC6.3 95.26,89.04 94.02,87.8 C20.1 | C20.1 C21.1 84.67,87.8 v84.33,88.14 | v75.95,88.14 74.91,88.14 R85.2
  Bottom 0.508: v84.58,81.92 84.58,76.33 70.48,62.23 70.48,34.92 86.87,18.54 v92.58,18.54 130.18,18.54 138.18,10.54 143.38,10.54 143.76,10.92 143.76,22.1 144.15,22.48 X13.11 | v84.33,88.14 v75.95,88.14
V_5V0_HMI  (via drill 0.35)
  Top 0.508: R63.2 111.33,16.93 C26.2 110.47,16.4 Q14.3 110.41,14.99 v109.22,14.99 | C28.2 96.24,16.4 Q12.3 96.19,14.99 v94.87,14.99 | C28.2 98.47,18.63 R59.2 | R67.2 105.08,18.63 C27.2 103.38,15.06 Q16.3 103.3,14.99 v102.11,14.99 | R68.2 C28.2
  Bottom 0.508: v94.87,14.99 v102.11,14.99 v109.22,14.99
V_24V0
  Top 0.508: C49.1 137.51,89.41 SW1.1 144.15,96.04 144.15,108.08 135.13,117.09 X1.1
V_24V0_P  (via drill 0.35)
  Top 0.254: v67.44,36.32 R40.2
  Top 0.508: Q6.3 69.23,15.66 R24.2 66.55,13.97 v66.29,13.72 | v52.7,13.97 50.71,13.97 R32.2 51.07,15.91 Q8.3 | R2.2 55.12,64.14 54.71,64.54 Q1.3 52.58,64.75 v52.58,65.79 | R10.2 55.37,43.69 54.08,44.98 Q3.3 52.38,46.53 v52.7,46.86 | C18.1 124.79,87.92 124.79,91.29 Q5.3 124.57,91.67 123.27,92.96 D3.3 120.02,93.47 118.73,94.76 IC8.3
  Bottom 0.254: 54.48,36.32 v67.44,36.32
  Bottom 0.508: 54.48,65.79 54.48,79.38 68.33,93.22 119.09,93.22 C18.1 | 54.48,65.79 54.48,46.86 | 54.48,46.86 54.48,36.32 54.48,15.75 v52.7,13.97 53.85,15.11 64.9,15.11 v66.29,13.72 | 54.48,65.79 v52.58,65.79 | 54.48,46.86 v52.7,46.86
V_CONDUCTIV
  Top 0.254: D6.2 81.43,6.93 81.43,8.38
  Top 0.508: X3.3 78.74,5.33 79.84,6.44 C7.2 81.43,8.38 R21.2 81.72,8.29 R22.2
V_PH
  Top 0.254: D4.2 64.01,6.78 R18.2
  Top 0.508: X4.3 62.32,4.66 C6.2 62.42,8.23 R18.2 64.45,7.79 R19.2
VCC  (via drill 0.35)  (4 unrouted)
  Top 0.203: D8.2 D7.2 84.71,25.19 84.71,37.43 C68.2 | C68.2 83.82,38.57 | C61.2 91.82,38.48 90.81,39.5 87.5,39.5 86.86,40.14 U2.127 | C50.2 102.74,57.15 99.57,53.98 97.36,53.98 U2.21 | U2.90 74.3,52.96 72.22,55.03 C56.2 | U2.142 94.36,39.96 C60.2 | C65.2 85.72,39.79 86.36,40.43 U2.126 | C68.2 83.69,40.03 83.86,40.2 U2.121 | 78.36,40.39 78.44,40.39 78.86,40.81 U2.111 | C59.2 72.42,48.45 U2.99 | C58.2 73.23,57.91 73.71,57.43 75.86,57.43 U2.81
  Top 0.254: 89.53,71.25 C53.2 | X2.1 70.7,71.29 C40.1 74.93,69.09 v77.03,66.99 | v85.34,69.6 85.6,69.85 R84.1 C55.2 C44.1 81.53,69.01 79.86,67.34 U2.68 | C58.2 C56.2 | 74.04,30.61 74.04,38.7 C66.2 78.36,40.39 | 74.04,30.61 74.04,28.7 73.15,27.81 v66.42,27.81 | v66.42,25.91 66.42,24.81 D5.2 | v62.99,25.91 62.99,24.81 D9.2 | D10.2 74.03,30.62 74.04,30.61 | C53.2 89.36,71.11 U2.49 | C53.2 v91.19,71.29 105.36,71.29 108.08,74 R14.2 R15.2 C3.1
  Top 0.508: D11.2 98.81,95.74 98.63,95.91 | IC6.4 98.63,95.91 | IC6.2 IC6.4 | IC6.4 92.61,96.27 D12.1 87.88,96.09 C22.1 C23.1 84.92,92.8 83.06,90.93 v81.41,90.93 | IC6.4 92.96,98.2 78.55,112.61 C37.1 65.37,112.61 J1.J2_20 65.28,115.06 63.03,117.31 R83.1 | v72.01,90.93 62.06,90.93 61.21,91.78 C38.1 J1.J3_18 | v72.39,49.4 72.39,48.43 C59.2 | C65.2 C64.2 C63.2 | C62.2 C61.2 | v72.26,59.05 72.26,57.95 C58.2 | v107.06,90.55 107.06,93.47 104.62,95.91 98.63,95.91 | v72.39,41.66 72.39,40.42 C66.2 | v110.49,60.71 110.77,60.98 R54.2 112.94,60.56 D13.2 | C60.2 C67.2
  Bottom 0.254: v66.42,27.81 v66.42,25.91 v62.99,25.91
  Bottom 0.508: v83.69,38.48 74.3,38.48 71.63,41.15 71.63,41.66 | v93.85,38.48 93.73,38.48 | 71.63,41.66 71.63,49.4 | 71.63,49.4 71.63,59.18 | 71.63,59.18 71.63,61.59 v77.03,66.99 79.63,69.6 v85.34,69.6 91.19,69.6 | v107.06,90.55 107.06,72.77 103.89,69.6 | v81.41,90.93 v72.01,90.93 | 71.63,49.4 v72.39,49.4 | 71.63,59.18 71.75,59.05 v72.26,59.05 | 71.63,41.66 v72.39,41.66 | 91.19,69.6 103.89,69.6 | 103.89,69.6 103.89,59.69 | 103.89,59.69 103.89,57.66 104.39,57.15 C50.2 | 103.89,59.69 109.47,59.69 v110.49,60.71 | 91.19,69.6 v91.19,71.29 91.19,71.37
  Bottom 1.016: v83.69,38.48 v85.72,38.48 v87.76,38.48 v89.79,38.48 v93.85,38.48 v97.92,38.48 98.42,38.48
  other vias: 104.31,57.15 83.57,69.6 81.53,69.6
  pour Top (no thermals): 86.11,71.5 86.11,69.6 85.34,68.83 81.79,68.83 81.03,69.6 81.03,71.5
  pour Top (no thermals): 86.11,71.5 86.11,69.6 85.34,68.83 81.79,68.83 81.03,69.6 81.03,71.5
  pour Bottom: 85.34,68.83 81.79,68.83 81.03,69.6 81.03,71.63 86.11,71.63 86.11,69.6
VCC_CONDUCTIV_SENSOR_SW
  Top 0.305: C8.1 72.66,8.38
  Top 0.508: X3.1 72.64,4.83 R28.2 | IC3.4 75.59,12.47 72.64,9.53 R28.2 | R28.2 72.66,8.38
VCC_DISPLAY_2
  Top 0.254: X13.9 144.49,25.02 V7.2 141.69,22.23 139.06,22.23 136.53,19.68 136.53,7.37 135,5.84 108.66,5.84 Q16.4
  Top 0.508: Q16.2 Q16.4
VCC_DISPLAY_3
  Top 0.254: X13.10 148.34,23.37 146.05,21.08 143.85,21.08 V8.2 141.95,19.18 137.54,19.18 137.03,18.67 137.03,7.11 135.25,5.33 102.06,5.33 Q12.4
  Top 0.508: Q12.2 Q12.4
VCC_DSIPLAY_1
  Top 0.254: X13.8 148.21,26.16 144.53,26.16 144.02,26.67 V6.2 141.57,25.15 139.45,25.15 136.02,21.72 136.02,7.62 134.75,6.35 115.27,6.35 Q14.4
  Top 0.508: Q14.2 Q14.4
VCC_PH_SENSOR_SW
  Top 0.508: IC4.4 58.19,12.47 55.12,9.4 R36.2 | X4.1 55.12,4.57 R36.2 | R36.2 57.55,8.11 C10.1

## Text on the board
tPlace: Aqua Dosing Controller | HW01.0y